# EAGLE design programmer_ICSP_atmega328 (EAGLE 6.1)
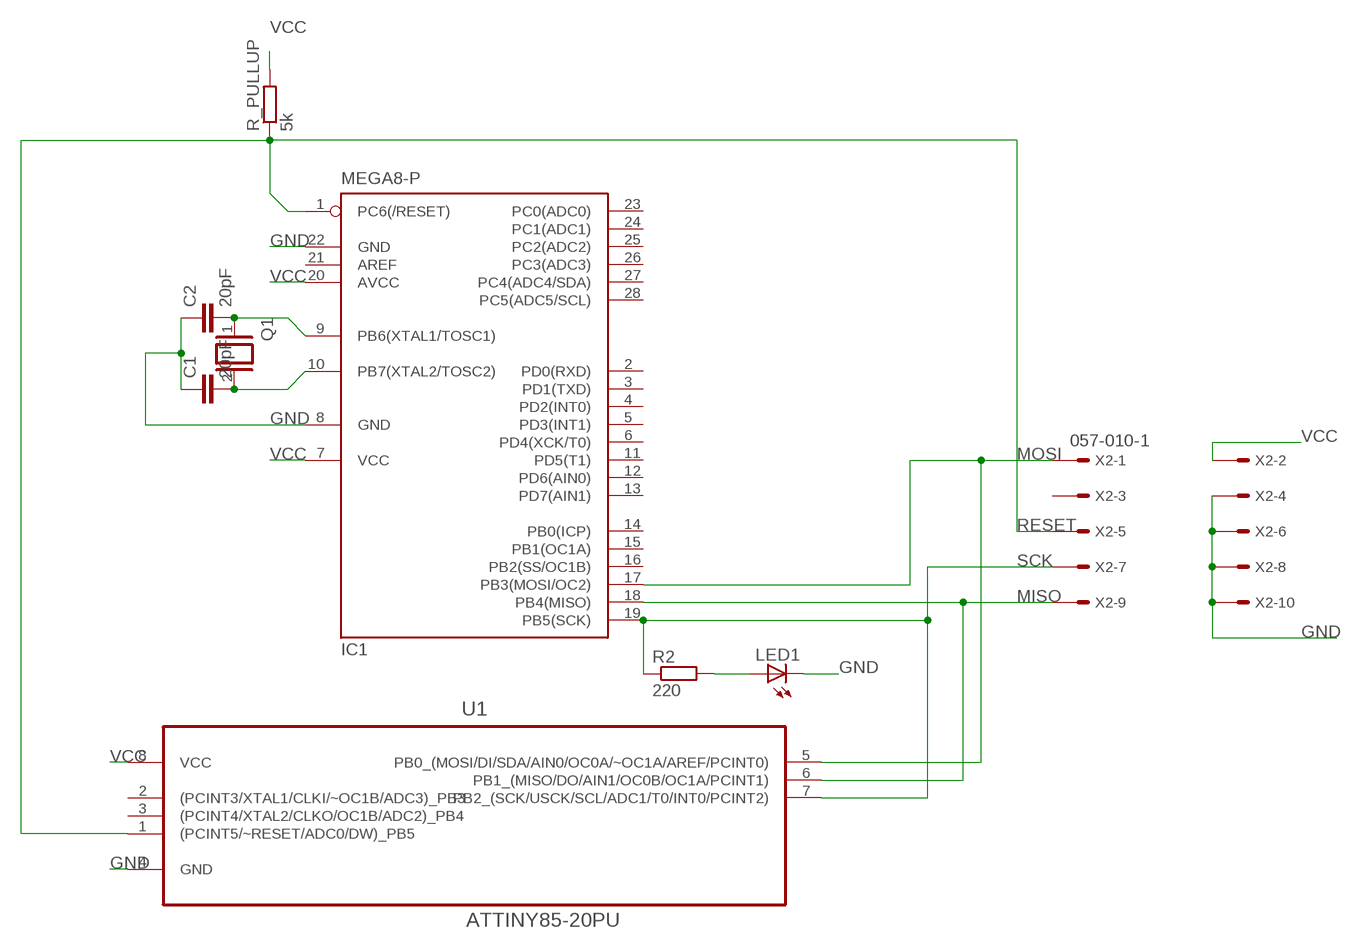
[diagram p0: schematic, sheet 1]

## Parts
C1  20pF  C5/5  [C5B5]
C2  20pF  C5/5  [C5B5]
IC1  MEGA8-P  [DIL28-3]
LED1  LED3MM  [LED3MM]
Q1  XTAL/S  [QS]
R2  220  R-EU_0207/7  [0207/7]
R_PULLUP  5k  R-EU_0207/7  [0207/7]
U1  ATTINY85-20PU  [DIP254P762X533-8]
X2  057-010-1  [057-010-1]

## Nets
GND: C1.1 C2.1 IC1.8(GND) IC1.22(GND) LED1.K(C) U1.4(GND) X2.4 X2.6 X2.8 X2.10
JUJU: LED1.A R2.2
MISO: IC1.18(PB4(MISO)) U1.6(PB1_(MISO/DO/AIN1/OC0B/OC1A/PCINT1)) X2.9
MOSI: IC1.17(PB3(MOSI/OC2)) U1.5(PB0_(MOSI/DI/SDA/AIN0/OC0A/~OC1A/AREF/PCINT0)) X2.1
N$5: C2.2 IC1.9(PB6(XTAL1/TOSC1)) Q1.1
N$6: C1.2 IC1.10(PB7(XTAL2/TOSC2)) Q1.2
RESET: IC1.1(PC6(/RESET)) R_PULLUP.1 U1.1((PCINT5/~RESET/ADC0/DW)_PB5) X2.5
SCK: IC1.19(PB5(SCK)) R2.1 U1.7(PB2_(SCK/USCK/SCL/ADC1/T0/INT0/PCINT2)) X2.7
VCC: IC1.7(VCC) IC1.20(AVCC) R_PULLUP.2 U1.8(VCC) X2.2
Unconnected: IC1.2(PD0(RXD)) IC1.3(PD1(TXD)) IC1.4(PD2(INT0)) IC1.5(PD3(INT1)) IC1.6(PD4(XCK/T0)) IC1.11(PD5(T1)) IC1.12(PD6(AIN0)) IC1.13(PD7(AIN1)) IC1.14(PB0(ICP)) IC1.15(PB1(OC1A)) IC1.16(PB2(SS/OC1B)) IC1.21(AREF) IC1.23(PC0(ADC0)) IC1.24(PC1(ADC1)) IC1.25(PC2(ADC2)) IC1.26(PC3(ADC3)) IC1.27(PC4(ADC4/SDA)) IC1.28(PC5(ADC5/SCL)) U1.2((PCINT3/XTAL1/CLKI/~OC1B/ADC3)_PB3) U1.3((PCINT4/XTAL2/CLKO/OC1B/ADC2)_PB4) X2.3

## Library data of the parts
C1 C2 = capacitor-wima:C: CAPACITOR naming: grid - package width
IC1 = atmel:MEGA8-P: MICROCONTROLLER 8 Kbytes FLASH, 1 kbytes SRAM, 512 bytes EEPROM, USART, 4-channel 10 bit ADC, 2-channel 8 bit ADC Pin compatible with Atmega48, ATMega88, ATMega168 Source: avr.lbr; OC_FARNELL: unknown; OC_NEWARK: unknown
LED1 = led:LED: LED OSRAM: - CHIPLED LG R971, LG N971, LY N971, LG Q971, LY Q971, LO R971, LY R971 LH N974, LH R974 LS Q976, LO Q976, LY Q976 LO Q996 - Hyper CHIPLED LW Q18S LB Q993, LB Q99A, LB R99A - SideLED LS A670, LO A670, LY A670, LG A670, LP A670 LB A673, LV A673, LT A673, LW A673 LH A674 LY A675 LS A676, LA A676, LO A676, LY A676, LW A676 LS A679, LY A679, LG A679 - Hyper Micro SIDELED® LS Y876, LA Y876, LO Y876, LY Y876 LT Y87S - SmartLED LW L88C, LW L88S LB L89C, LB L89S, LG L890 LS L89K, LO L89K, LY L89K LS L896, LA L896, LO L896, LY L896 - TOPLED LS T670, LO T670, LY T670, LG T670, LP T670 LSG T670, LSP T670, LSY T670, LOP T670, LYG T670 LG T671, LOG T671, LSG T671 LB T673, LV T673, LT T673, LW T673 LH T674 LS T676, LA T676, LO T676, LY T676, LB T676, LH T676, LSB T676, LW T676 LB T67C, LV T67C, LT T67C, LS T67K, LO T67K, LY T67K, LW E67C LS E67B, LA E67B, LO E67B, LY E67B, LB E67C, LV E67C, LT E67C LW T67C LS T679, LY T679, LG T679 LS T770, LO T770, LY T770, LG T770, LP T770 LB T773, LV T773, LT T773, LW T773 LH T774 LS E675, LA E675, LY E675, LS T675 LS T776, LA T776, LO T776, LY T776, LB T776 LHGB T686 LT T68C, LB T68C - Hyper Mini TOPLED® LB M676 - Mini TOPLED Santana® LG M470 LS M47K, LO M47K, LY M47K Source: http://www.osram.convergy.de LUXEON: - LUMILED® LXK2-PW12-R00, LXK2-PW12-S00, LXK2-PW14-U00, LXK2-PW14-V00 LXK2-PM12-R00, LXK2-PM12-S00, LXK2-PM14-U00 LXK2-PE12-Q00, LXK2-PE12-R00, LXK2-PE12-S00, LXK2-PE14-T00, LXK2-PE14-U00 LXK2-PB12-K00, LXK2-PB12-L00, LXK2-PB12-M00, LXK2-PB14-N00, LXK2-PB14-P00, LXK2-PB14-Q00 LXK2-PR12-L00, LXK2-PR12-M00, LXK2-PR14-Q00, LXK2-PR14-R00 LXK2-PD12-Q00, LXK2-PD12-R00, LXK2-PD12-S00 LXK2-PH12-R00, LXK2-PH12-S00 LXK2-PL12-P00, LXK2-PL12-Q00, LXK2-PL12-R00 Source: www.luxeon.com KINGBRIGHT: KA-3528ASYC Source: www.kingbright.com
Q1 = special:XTAL/S: CRYSTAL
R2 R_PULLUP = rcl:R-EU_: RESISTOR, European symbol
U1 = Atmel_By_element14_Batch_1-00:ATTINY85-20PU: 8-bit Microcontroller with In-System Programmable Flash; MPN: ATTINY85-20PU; OC_FARNELL: 1455162; OC_NEWARK: 58M3796; PACKAGE: PDIP-8; SUPPLIER: Atmel
X2 = con-panduit:057-010-: CONNECTOR 10-pin series 057 contact pc board low profile headers; OC_FARNELL: unknown; OC_NEWARK: unknown

## Board
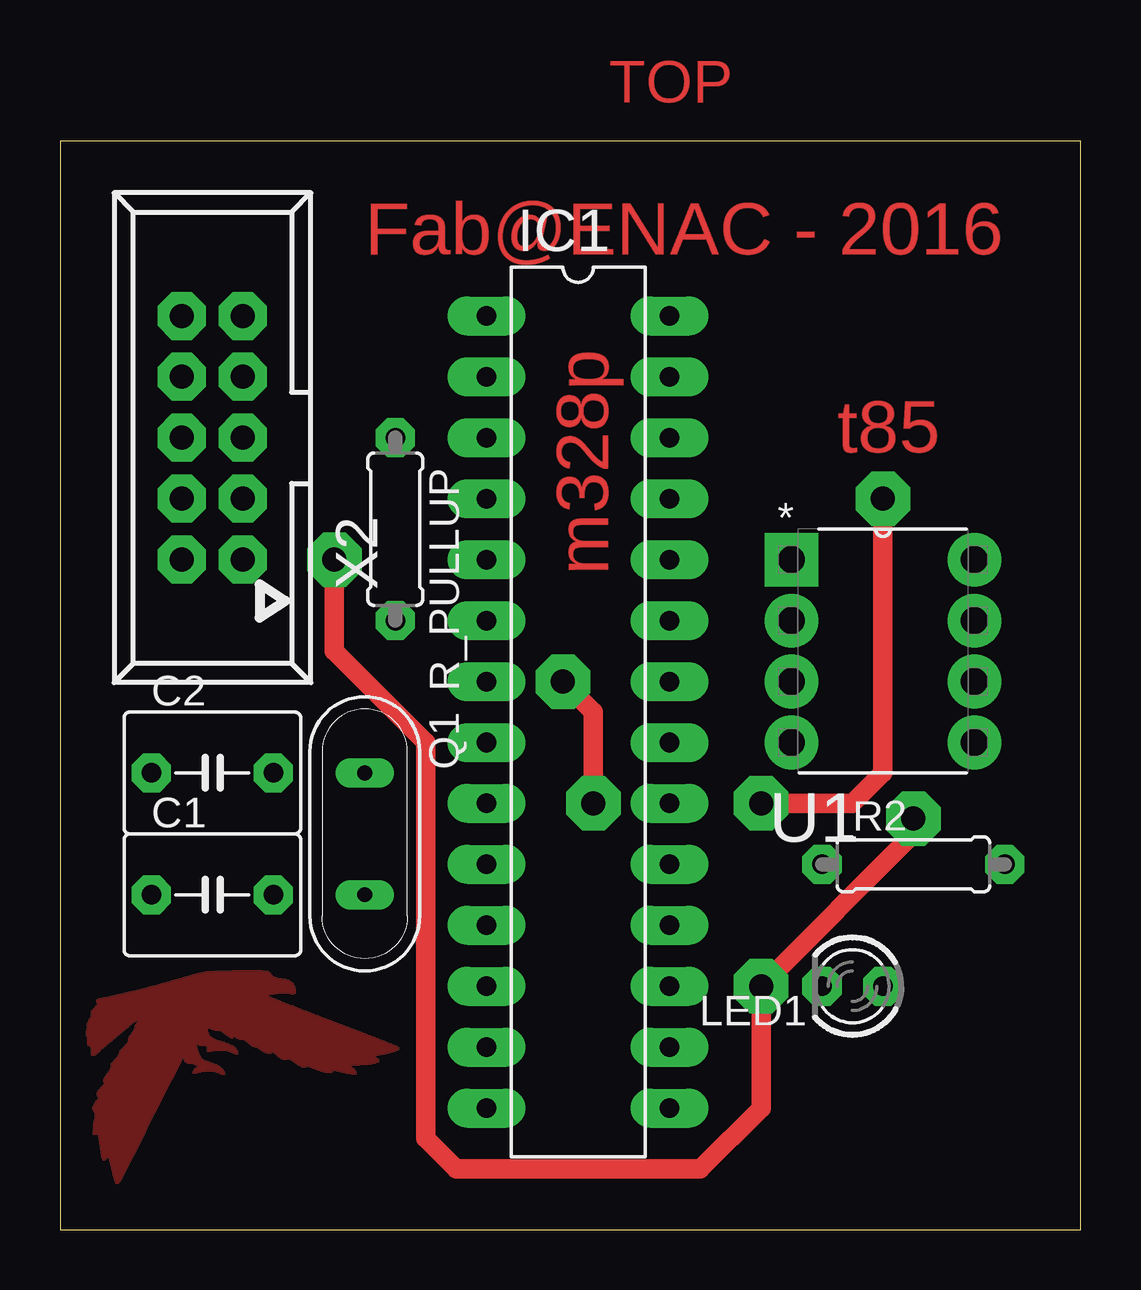
[diagram p1: board, top side]
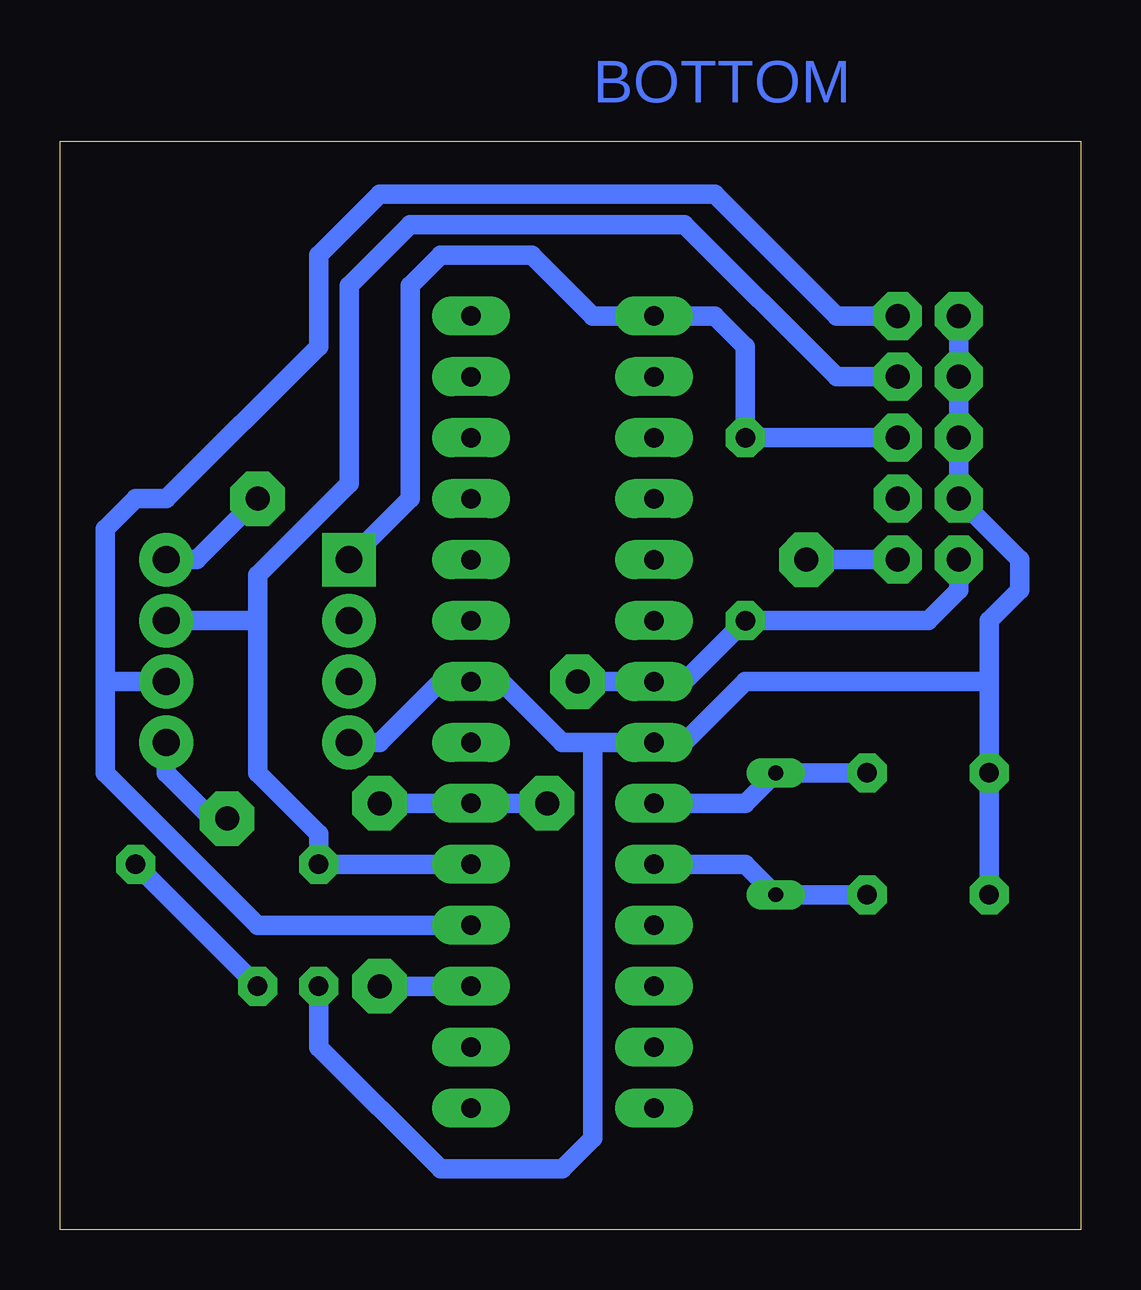
[diagram p2: board, bottom side, seen from below]

Size 42.52 x 45.39 mm. Coordinates in mm from the lower left corner, seen from the top.
Outline: 0,0 42.52,0 42.52,45.39 0,45.39 0,0
Copper layers (1*16): Top 0.035mm / dielectric 1.5mm / Bottom 0.035mm
Design rules: minimum track width 10mil, minimum drill 24mil, track to track 8mil, track to pad 8mil, pad to pad 8mil, via to via 8mil, smd to smd 8mil, copper to edge 40mil, drill to drill 8mil, minimum pad ring 10mil, minimum via ring 25mil, stop-mask expansion 4mil, vias tented up to drill 0mil, thermal gap 10mil

### Footprints (pad centres in the part's own frame; a part is rotated, then mirrored left to right if it is on the bottom)
C5B5 = drill 0.813 pad 1.6 octagon: 1 -2.54,0; 2 2.54,0
DIL28-3 = drill 0.813 long: 1 -16.51,-3.81; 2 -13.97,-3.81; 3 -11.43,-3.81; 4 -8.89,-3.81; 5 -6.35,-3.81; 6 -3.81,-3.81; 7 -1.27,-3.81; 8 1.27,-3.81; 9 3.81,-3.81; 10 6.35,-3.81; 11 8.89,-3.81; 12 11.43,-3.81; 13 13.97,-3.81; 14 16.51,-3.81; 15 16.51,3.81; 16 13.97,3.81; 17 11.43,3.81; 18 8.89,3.81; 19 6.35,3.81; 20 3.81,3.81; 21 1.27,3.81; 22 -1.27,3.81; 23 -3.81,3.81; 24 -6.35,3.81; 25 -8.89,3.81; 26 -11.43,3.81; 27 -13.97,3.81; 28 -16.51,3.81
LED3MM = drill 0.813 octagon: A -1.27,0; K 1.27,0
QS = drill 0.61 long: 1 -2.54,0; 2 2.54,0
0207/7 = drill 0.813 octagon: 1 -3.81,0; 2 3.81,0
DIP254P762X533-8 = drill 1.118 square: 1 -7.62,7.62 | drill 1.118: 2 -7.62,5.08; 3 -7.62,2.54; 4 -7.62,0; 5 0,0; 6 0,2.54; 7 0,5.08; 8 0,7.62
057-010-1 = drill 1 octagon: 1 -5.08,-1.27; 2 -5.08,1.27; 3 -2.54,-1.27; 4 -2.54,1.27; 5 0,-1.27; 6 0,1.27; 7 2.54,-1.27; 8 2.54,1.27; 9 5.08,-1.27; 10 5.08,1.27

### Placement (x,y rotation side)
C1  6.35,13.97 0 top
C2  6.35,19.05 0 top
IC1  21.59,21.59 270 top
LED1  33.02,10.16 180 top
Q1  12.7,16.51 270 top
R2  35.56,15.24 0 top
R_PULLUP  13.97,29.21 270 top
U1  38.1,20.32 0 top
X2  6.35,33.02 90 top

### Tracks (layer width: path | path; a pad name or v marks a point on that pad's centre or on a via)
GND
  Bottom 0.813: C1.1 C2.1 3.81,22.86 | X2.10 X2.8 X2.6 X2.4 2.54,27.94 2.54,26.67 3.81,25.4 3.81,22.86 | U1.4 29.21,20.32 26.67,22.86 IC1.22 24.13,22.86 21.59,20.32 20.32,20.32 | 20.32,20.32 IC1.8 16.51,20.32 13.97,22.86 3.81,22.86 | LED1.K 31.75,7.62 26.67,2.54 21.59,2.54 20.32,3.81 20.32,20.32
JUJU
  Bottom 0.813: R2.2 LED1.A
MISO
  Bottom 0.813: X2.9 10.16,38.1 15.24,43.18 29.21,43.18 31.75,40.64 31.75,36.83 38.1,30.48 39.37,30.48 40.64,29.21 40.64,22.86 | 40.64,22.86 U1.6 | IC1.18 34.29,12.7 40.64,19.05 40.64,22.86
MOSI  (via drill 1)
  Top 0.813: v11.43,27.94 11.43,24.13 15.24,20.32 15.24,3.81 16.51,2.54 26.67,2.54 29.21,5.08 v29.21,10.16 35.56,16.51 v35.56,17.14
  Bottom 0.813: X2.1 v11.43,27.94 | v29.21,10.16 IC1.17 | U1.5 38.1,19.05 36.2,17.14 v35.56,17.14
N$1
  pour Top: 5.59,10.35 5.71,10.38 5.83,10.42 5.8,10.48 5.65,10.45 5.5,10.43 5.33,10.39 5.17,10.33 5.08,10.28 5.23,10.3 5.41,10.32 5.59,10.35
N$2
  pour Top: 8.3,10.3 8.14,10.31 8.25,10.26
N$3
  pour Top: 7.45,10.24 7.6,10.28 7.76,10.33 7.91,10.37 8.07,10.42 8.19,10.46 8.32,10.5 8.44,10.47 8.59,10.44 8.58,10.51 8.42,10.59 8.24,10.6 8.06,10.6 7.88,10.6 7.7,10.6 7.52,10.59 7.36,10.59 7.19,10.58 7.03,10.58 6.87,10.58 6.7,10.57 6.54,10.58 6.4,10.58 6.27,10.56 6.31,10.44 6.38,10.33 6.45,10.22 6.56,10.14 6.7,10.13 6.84,10.14 7,10.15 7.15,10.17 7.3,10.2 7.45,10.24
N$4
  pour Top: 5.15,9.9 5.34,9.92 5.53,9.94 5.63,10.02 5.69,10.14 5.62,10.19 5.48,10.17 5.34,10.15 5.17,10.12 5,10.08 4.86,10.02 4.74,9.92 4.76,9.85 4.89,9.87 5.02,9.88 5.15,9.9
N$5
  Bottom 0.813: IC1.9 13.97,17.78 Q1.1 C2.2
N$6
  Bottom 0.813: IC1.10 13.97,15.24 Q1.2 C1.2
N$7
  pour Top: 6.6,9.57 6.77,9.61 6.94,9.65 7.11,9.69 7.27,9.73 7.46,9.78 7.65,9.82 7.84,9.86 8.02,9.9 8.21,9.93 8.4,9.97 8.59,9.99 8.78,10.01 8.97,10.03 9.17,10.04 9.31,10.04 9.45,10.05 9.59,10.08 9.48,10.17 9.35,10.24 9.21,10.28 9.02,10.3 8.84,10.29 8.66,10.26 8.48,10.22 8.32,10.19 8.16,10.19 7.99,10.2 7.82,10.17 7.65,10.13 7.48,10.09 7.33,10.05 7.18,10.01 7.03,9.98 6.87,9.95 6.72,9.93 6.56,9.92 6.39,9.9 6.32,9.74 6.27,9.62 6.25,9.5 6.42,9.53 6.6,9.57
N$8
  pour Top: 5.25,9.44 5.39,9.53 5.49,9.67 5.35,9.72 5.18,9.72 5.03,9.71 4.87,9.7 4.73,9.65 4.58,9.56 4.49,9.43 4.68,9.41 4.87,9.41 5.06,9.42 5.25,9.44
N$9
  pour Top: 2.32,9.45 2.49,9.51 2.67,9.57 2.84,9.63 2.99,9.72 2.94,9.75 2.78,9.72 2.63,9.69 2.48,9.66 2.33,9.64 2.18,9.6 2.04,9.56 1.94,9.44 1.89,9.36 1.99,9.37 2.15,9.41 2.32,9.45
N$10
  pour Top: 2.85,9.36 2.99,9.46 3,9.52 2.86,9.48 2.71,9.44 2.55,9.4 2.38,9.35 2.21,9.3 2.04,9.25 1.88,9.18 1.76,9.06 1.95,9.09 2.13,9.14 2.31,9.19 2.49,9.24 2.67,9.3 2.85,9.36
N$11
  pour Top: 5.07,9.02 5.2,9.13 5.24,9.25 5.05,9.24 4.87,9.23 4.68,9.21 4.49,9.18 4.35,9.12 4.26,9 4.45,8.98 4.64,8.98 4.78,8.99 4.93,9 5.07,9.02
N$12
  pour Top: 3.58,9.13 3.66,9.2 3.73,9.29 3.74,9.41 3.84,9.51 3.95,9.62 3.92,9.71 3.9,9.76 3.97,9.84 4.06,9.98 3.89,9.96 3.72,9.93 3.55,9.89 3.38,9.86 3.22,9.79 3.2,9.68 3.19,9.56 3.18,9.4 3.2,9.23 3.25,9.07 3.37,8.97 3.48,9.04 3.58,9.13
N$13
  pour Top: 9.74,8.96 9.79,9.07 9.62,9.14 9.45,9.21 9.29,9.27 9.12,9.34 8.94,9.4 8.77,9.46 8.61,9.52 8.44,9.58 8.27,9.64 8.1,9.7 7.91,9.67 7.79,9.64 7.67,9.63 7.67,9.56 7.8,9.5 7.98,9.42 8.15,9.35 8.32,9.28 8.5,9.21 8.67,9.15 8.85,9.08 9.03,9.03 9.21,8.98 9.4,8.95 9.57,8.93 9.74,8.96
N$14
  pour Top: 6.46,8.91 6.46,9.05 6.44,9.2 6.41,9.34 6.31,9.36 6.21,9.31 6.17,9.18 6.18,9.08 6.19,8.98 6.23,8.85 6.38,8.82 6.46,8.91
N$15
  pour Top: 7.02,8.66 7.05,8.79 7.04,8.93 7.03,9.06 7.01,9.2 7,9.33 6.96,9.46 6.77,9.44 6.62,9.4 6.61,9.21 6.62,9.04 6.63,8.88 6.68,8.76 6.79,8.69 6.9,8.64 7.02,8.66
N$16
  pour Top: 2.09,8.79 2.25,8.85 2.4,8.91 2.56,8.98 2.71,9.05 2.86,9.12 2.99,9.22 2.95,9.24 2.81,9.19 2.66,9.15 2.51,9.1 2.35,9.05 2.19,8.99 2.03,8.93 1.87,8.86 1.75,8.8 1.66,8.7 1.67,8.63 1.81,8.68 1.95,8.74 2.09,8.79
N$17
  pour Top: 4.89,8.55 4.96,8.66 5.01,8.79 4.84,8.81 4.66,8.81 4.48,8.81 4.3,8.79 4.13,8.72 4.02,8.58 4.15,8.51 4.31,8.51 4.48,8.5 4.62,8.5 4.76,8.51 4.89,8.55
N$18
  pour Top: 7.57,8.54 7.57,8.73 7.55,8.92 7.53,9.11 7.51,9.3 7.46,9.39 7.36,9.44 7.21,9.49 7.16,9.34 7.16,9.17 7.16,9 7.17,8.82 7.21,8.65 7.3,8.51 7.38,8.44 7.48,8.43 7.57,8.54
N$19
  pour Top: 8.08,8.42 8.07,8.61 8.04,8.79 8.02,8.97 7.98,9.16 7.85,9.25 7.7,9.31 7.68,9.14 7.68,8.96 7.68,8.79 7.69,8.61 7.72,8.44 7.79,8.33 7.89,8.24 8.02,8.19 8.09,8.2 8.08,8.31
N$20
  pour Top: 1.86,8.29 2.01,8.37 2.15,8.46 2.3,8.55 2.44,8.64 2.59,8.73 2.73,8.83 2.87,8.92 3.01,9.03 2.83,8.97 2.65,8.89 2.48,8.81 2.31,8.72 2.14,8.63 1.98,8.55 1.81,8.46 1.65,8.38 1.64,8.28 1.65,8.19 1.76,8.24 1.86,8.29
N$21
  pour Top: 4.69,8.16 4.72,8.32 4.54,8.33 4.36,8.33 4.21,8.34 4.06,8.33 3.91,8.3 3.79,8.2 3.73,8.1 3.88,8.09 4.03,8.08 4.18,8.08 4.33,8.08 4.48,8.08 4.63,8.08
N$22
  pour Top: 8.6,8.12 8.59,8.28 8.57,8.44 8.56,8.59 8.54,8.73 8.52,8.86 8.46,8.98 8.33,9.05 8.19,9.07 8.2,8.89 8.21,8.7 8.23,8.51 8.24,8.33 8.27,8.14 8.42,8.05 8.58,7.99 8.6,8.12
N$23
  pour Top: 1.94,7.95 2.08,8.06 2.21,8.16 2.35,8.27 2.48,8.38 2.61,8.49 2.75,8.6 2.87,8.72 2.93,8.8 2.78,8.71 2.63,8.61 2.48,8.52 2.34,8.42 2.19,8.33 2.05,8.23 1.91,8.13 1.76,8.03 1.63,7.92 1.66,7.77 1.8,7.86 1.94,7.96
N$24
  pour Top: 9.23,7.8 9.21,7.96 9.19,8.12 9.16,8.28 9.14,8.44 9.11,8.6 9.08,8.76 8.96,8.81 8.84,8.85 8.71,8.89 8.72,8.7 8.73,8.51 8.75,8.32 8.77,8.14 8.8,7.95 8.89,7.83 9.01,7.75 9.15,7.72 9.22,7.8
N$25
  pour Top: 4.46,7.7 4.51,7.81 4.34,7.86 4.16,7.88 3.98,7.9 3.81,7.91 3.66,7.86 3.54,7.78 3.47,7.65 3.63,7.61 3.79,7.61 3.95,7.61 4.1,7.61 4.26,7.61 4.41,7.61
N$26
  pour Top: 12.94,7.57 13.08,7.61 13.21,7.66 13.27,7.73 13.12,7.79 12.97,7.85 12.82,7.91 12.66,7.97 12.51,8.03 12.34,8.1 12.18,8.16 12.01,8.23 11.84,8.29 11.67,8.36 11.5,8.42 11.34,8.48 11.17,8.55 11,8.61 10.83,8.67 10.66,8.73 10.49,8.79 10.35,8.84 10.21,8.88 10.09,8.89 10.18,8.83 10.28,8.77 10.44,8.69 10.59,8.61 10.75,8.53 10.9,8.45 11.06,8.36 11.22,8.27 11.39,8.19 11.55,8.1 11.71,8.01 11.88,7.93 12.04,7.84 12.21,7.76 12.38,7.68 12.54,7.6 12.72,7.53 12.83,7.55 12.94,7.57
N$27
  pour Top: 9.98,7.41 9.93,7.59 9.87,7.74 9.81,7.89 9.76,8.04 9.71,8.2 9.65,8.36 9.6,8.52 9.51,8.67 9.35,8.71 9.27,8.71 9.29,8.59 9.32,8.41 9.35,8.24 9.38,8.06 9.41,7.93 9.44,7.79 9.46,7.65 9.56,7.57 9.67,7.5 9.79,7.43 9.89,7.39 9.98,7.41
N$28
  pour Top: 12.17,7.31 12.33,7.39 12.18,7.5 12.03,7.59 11.87,7.69 11.71,7.78 11.56,7.87 11.4,7.97 11.24,8.06 11.08,8.15 10.92,8.24 10.76,8.33 10.6,8.42 10.44,8.51 10.28,8.6 10.12,8.68 10.21,8.56 10.33,8.44 10.46,8.32 10.58,8.2 10.71,8.08 10.84,7.96 10.96,7.85 11.09,7.73 11.22,7.62 11.34,7.51 11.46,7.4 11.6,7.3 11.75,7.24 11.91,7.24 12.04,7.27 12.17,7.31
N$29
  pour Top: 10.73,7.16 10.64,7.32 10.54,7.48 10.43,7.63 10.33,7.79 10.22,7.94 10.11,8.09 10,8.25 9.92,8.36 9.84,8.47 9.76,8.57 9.79,8.41 9.85,8.26 9.9,8.11 9.96,7.96 10.02,7.81 10.08,7.66 10.14,7.51 10.22,7.36 10.35,7.26 10.51,7.2 10.62,7.16 10.73,7.16
N$30
  pour Top: 11.38,7.21 11.27,7.32 11.17,7.43 11.06,7.54 10.95,7.65 10.82,7.78 10.69,7.91 10.56,8.03 10.42,8.16 10.29,8.29 10.19,8.39 10.08,8.49 9.97,8.58 10.05,8.43 10.15,8.3 10.24,8.16 10.34,8.03 10.44,7.9 10.53,7.76 10.63,7.63 10.75,7.48 10.86,7.33 11,7.2 11.18,7.13 11.34,7.12 11.46,7.11
N$31
  pour Top: 3.97,7.09 4.1,7.12 4.21,7.2 4.27,7.33 4.16,7.39 4.03,7.39 3.89,7.4 3.73,7.4 3.57,7.39 3.41,7.37 3.28,7.31 3.18,7.22 3.12,7.1 3.12,7.03 3.29,7.04 3.46,7.05 3.63,7.06 3.8,7.07 3.97,7.09
N$32
  pour Top: 3.23,6.47 3.37,6.5 3.51,6.54 3.65,6.58 3.8,6.62 3.93,6.67 4.02,6.78 4.04,6.89 3.86,6.89 3.69,6.88 3.51,6.86 3.34,6.85 3.16,6.82 2.98,6.77 2.85,6.67 2.75,6.53 2.73,6.38 2.81,6.37 2.95,6.4 3.09,6.44 3.23,6.47
N$33
  pour Top: 5.28,8.09 5.37,8.26 5.45,8.43 5.54,8.6 5.62,8.77 5.7,8.94 5.79,9.11 5.87,9.28 5.95,9.45 6.04,9.62 6.12,9.79 6.21,9.96 6.29,10.12 6.24,10.26 6.2,10.36 6.14,10.45 6.03,10.33 5.94,10.16 5.85,10 5.77,9.83 5.68,9.67 5.6,9.5 5.51,9.33 5.43,9.17 5.34,9 5.26,8.83 5.17,8.67 5.09,8.5 5,8.33 4.92,8.17 4.83,8 4.75,7.83 4.66,7.67 4.58,7.5 4.49,7.33 4.41,7.17 4.33,7 4.24,6.84 4.16,6.67 4.16,6.56 4.16,6.44 4.17,6.31 4.19,6.17 4.26,6.07 4.35,6.23 4.43,6.4 4.52,6.57 4.61,6.74 4.69,6.91 4.78,7.08 4.86,7.25 4.95,7.42 5.03,7.59 5.12,7.76 5.2,7.93 5.28,8.1
N$34
  pour Top: 2.77,5.83 2.95,5.9 3.12,5.97 3.29,6.04 3.46,6.11 3.63,6.18 3.8,6.26 3.94,6.37 3.94,6.44 3.77,6.41 3.61,6.38 3.44,6.34 3.28,6.3 3.11,6.26 2.95,6.21 2.79,6.17 2.61,6.09 2.46,5.97 2.36,5.81 2.32,5.65 2.47,5.7 2.62,5.76 2.77,5.83
N$35
  pour Top: 2.51,5.06 2.67,5.17 2.83,5.28 2.98,5.39 3.14,5.51 3.29,5.62 3.44,5.74 3.59,5.85 3.74,5.97 3.88,6.11 3.71,6.04 3.54,5.97 3.37,5.89 3.21,5.82 3.04,5.74 2.88,5.66 2.71,5.58 2.55,5.5 2.38,5.42 2.23,5.33 2.14,5.19 2.08,5.05 2.04,4.89 2.04,4.76 2.2,4.85 2.36,4.96 2.51,5.06
N$36
  pour Top: 2.66,4.5 2.79,4.63 2.92,4.76 3.05,4.89 3.18,5.02 3.31,5.15 3.43,5.29 3.56,5.42 3.69,5.55 3.81,5.69 3.93,5.83 4.04,5.97 3.89,5.9 3.76,5.8 3.62,5.7 3.49,5.59 3.36,5.49 3.23,5.39 3.1,5.28 2.96,5.17 2.83,5.06 2.69,4.95 2.55,4.84 2.42,4.73 2.32,4.65 2.22,4.56 2.12,4.47 2.11,4.33 2.13,4.19 2.2,4.07 2.32,4.18 2.44,4.28 2.55,4.39 2.66,4.5
N$37
  pour Top: 2.86,3.24 2.95,3.41 3.04,3.57 3.13,3.74 3.21,3.91 3.29,4.08 3.38,4.24 3.46,4.41 3.54,4.58 3.62,4.75 3.7,4.92 3.78,5.09 3.86,5.25 3.94,5.42 4.02,5.59 4.09,5.77 3.95,5.64 3.82,5.5 3.69,5.37 3.57,5.23 3.44,5.09 3.32,4.95 3.19,4.81 3.07,4.67 2.95,4.53 2.82,4.39 2.7,4.25 2.58,4.11 2.47,3.96 2.37,3.8 2.39,3.64 2.45,3.49 2.54,3.35 2.66,3.24 2.79,3.16 2.86,3.24
N$38
  pour Top: 355 corners
RESET
  Bottom 0.813: X2.5 R_PULLUP.1 13.97,36.83 15.24,38.1 IC1.1 20.32,38.1 22.86,40.64 26.67,40.64 27.94,39.37 27.94,30.48 U1.1
SCK
  Bottom 0.813: X2.7 10.16,35.56 16.51,41.91 27.94,41.91 30.48,39.37 30.48,31.11 34.29,27.3 34.29,25.4 | 34.29,25.4 34.29,19.05 31.75,16.51 R2.1 IC1.19 | U1.7 34.29,25.4
VCC  (via drill 1)
  Top 0.813: v34.29,30.48 34.29,19.05 33.02,17.78 v29.21,17.78 | v22.23,17.78 22.23,21.59 v20.95,22.86
  Bottom 0.813: X2.2 5.08,26.67 6.35,25.4 R_PULLUP.2 16.51,22.86 IC1.7 v20.95,22.86 | U1.8 36.83,27.94 v34.29,30.48 | v29.21,17.78 IC1.20 v22.23,17.78

### Text on the board
Top: TOP | Fab@ENAC - 2016 | t85 | m328p
Bottom: BOTTOM